# Altium project FGPA-DemoShield.PrjPcb
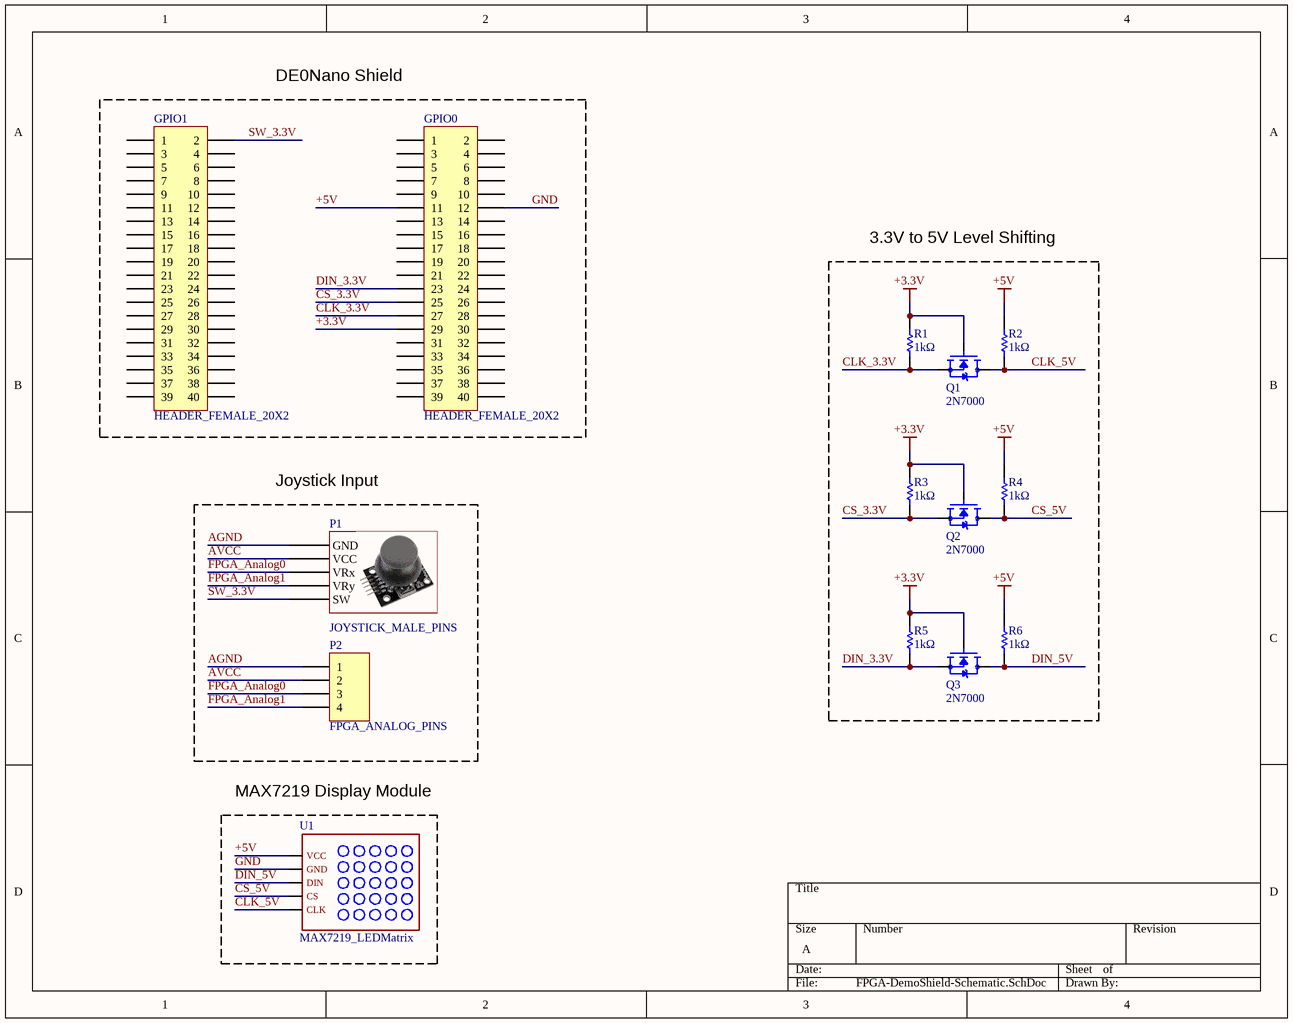
[diagram p0: FPGA-DemoShield-Schematic.SchDoc]
1 sheet, 14 parts. Net scope: global (net labels, ports and power ports of the same name join across sheets).
Board file: FPGA-DemoShield-PCB.PcbDoc

## Sheet FPGA-DemoShield-Schematic.SchDoc: RISC-PYVE Demo Board - Snake
size A; SheetNumber: 1; SheetTotal: 1

### Parts
GPIO0  HEADER_FEMALE_20X2  [HDR2X20_FEMALE]
GPIO1  HEADER_FEMALE_20X2  [HDR2X20_FEMALE]
P1  JOYSTICK_MALE_PINS  [HDR1X5_MALE]
P2  FPGA_ANALOG_PINS  [HDR1X4_MALE]
Q1  2N7000  [2N7000-TO-92]
Q2  2N7000  [2N7000-TO-92]
Q3  2N7000  [2N7000-TO-92]
R1  value 1kΩ  [RES_0805]  (hidden comment: RES_1k_0805)
R2  value 1kΩ  [RES_0805]  (hidden comment: RES_1k_0805)
R3  value 1kΩ  [RES_0805]  (hidden comment: RES_1k_0805)
R4  value 1kΩ  [RES_0805]  (hidden comment: RES_1k_0805)
R5  value 1kΩ  [RES_0805]  (hidden comment: RES_1k_0805)
R6  value 1kΩ  [RES_0805]  (hidden comment: RES_1k_0805)
U1  MAX7219_LEDMatrix  [LED_MATRIX]

### Blocks framed on the sheet
DE0Nano Shield: GPIO0 GPIO1
3.3V to 5V Level Shifting: Q1-Q3 R1-R6
Joystick Input: P1 P2
MAX7219 Display Module: U1

### Nets
+3.3V: GPIO0.29 Q1.2(G) Q2.2(G) Q3.2(G) R1.2 R3.2 R5.2
+5V: GPIO0.11 R2.2 R4.2 R6.2 U1.1(VCC)
AGND: P1.1(GND) P2.1
AVCC: P1.2(VCC) P2.2
CLK_3.3V: GPIO0.27 Q1.1(S) R1.1
CLK_5V: Q1.3(D) R2.1 U1.5(CLK)
CS_3.3V: GPIO0.25 Q2.1(S) R3.1
CS_5V: Q2.3(D) R4.1 U1.4(CS)
DIN_3.3V: GPIO0.23 Q3.1(S) R5.1
DIN_5V: Q3.3(D) R6.1 U1.3(DIN)
FPGA_Analog0: P1.3(VRx) P2.3
FPGA_Analog1: P1.4(VRy) P2.4
GND: GPIO0.12 U1.2(GND)
SW_3.3V: GPIO1.2 P1.5(SW)

Not connected (* = marked no-connect by the designer): GPIO0 1 2 3 4 5 6 7 8 9 10 13 14 15 16 17 18 19 20 21 22 24 26 28 30 31 32 33 34 35 36 37 38 39 40; GPIO1 1 3 4 5 6 7 8 9 10 11 12 13 14 15 16 17 18 19 20 21 22 23 24 25 26 27 28 29 30 31 32 33 34 35 36 37 38 39 40

### Library data of the parts
GPIO0 GPIO1 = HEADER_FEMALE_20X2: Header, 20-Pin, Dual row
P1 = JOYSTICK_MALE_PINS: Header, 5-Pin
P2 = FPGA_ANALOG_PINS: Header, 4-Pin
Q1-Q3 = 2N7000: MOSFET N-CH 60V 350MA TO92-3; MP: 2N7000; Package: TO-92
R1-R6 = RES_1k_0805: 1k RES 0805; Published: 8-Jun-2000; LatestRevisionDate: 17-Jul-2002; LatestRevisionNote: Re-released for DXP Platform.; PackageReference: AXIAL-0.3; Publisher: Altium Limited; PackageDescription: Axial Device, Thru-Hole; 2 Leads; 0.3 in Pin Spacing
U1 = MAX7219_LEDMatrix: LED MATRIX; Parameter 1: *